# EAGLE design ledboard_smallcon_vert (EAGLE 6.4)
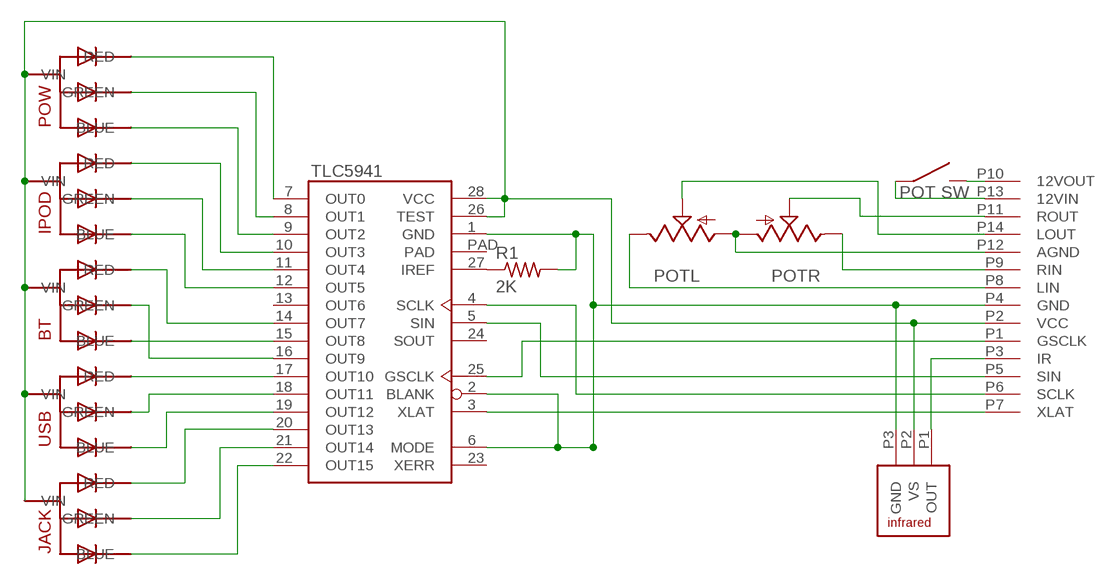
[diagram p0: schematic, sheet 1]

## Parts
BT  5MMRGBLEDBENT  [BENTLED]
IPOD  5MMRGBLEDBENT  [BENTLED]
IR  TSOP323  [TSOP323]
JACK  5MMRGBLEDBENT  [BENTLED]
POT  ALPS_RK0971221Z0N  [ALPS_RK0971221Z0X]
POW  5MMRGBLEDBENT  [BENTLED]
R1  2K  R-US_0207/7  [0207/7]
U$1  TLC5941  [HTSSOP28_POWERPAD]
U$3  CONNECTORSMALL2  [SMALL2]
USB  5MMRGBLEDBENT  [BENTLED]

## Nets
GND: IR.P3(GND) R1.2 U$1.1(GND) U$1.2(BLANK) U$1.6(MODE) U$3.P4(GND)
N$2: POW.P$4(RED) U$1.7(OUT0)
N$3: POW.P$2(GREEN) U$1.8(OUT1)
N$4: POW.P$1(BLUE) U$1.9(OUT2)
N$5: IPOD.P$4(RED) U$1.10(OUT3)
N$6: IPOD.P$2(GREEN) U$1.11(OUT4)
N$7: IPOD.P$1(BLUE) U$1.12(OUT5)
N$8: BT.P$4(RED) U$1.14(OUT7)
N$9: BT.P$1(BLUE) U$1.15(OUT8)
N$10: U$1.19(OUT12) USB.P$1(BLUE)
N$11: JACK.P$1(BLUE) U$1.22(OUT15)
N$12: BT.P$2(GREEN) U$1.16(OUT9)
N$13: U$1.17(OUT10) USB.P$4(RED)
N$14: U$1.4(SCLK) U$3.P6(SCLK)
N$15: JACK.P$4(RED) U$1.20(OUT13)
N$16: POT.G1 POT.G2 U$3.P12(AGND)
N$17: U$1.18(OUT11) USB.P$2(GREEN)
N$18: JACK.P$2(GREEN) U$1.21(OUT14)
N$19: R1.1 U$1.27(IREF)
N$21: U$1.5(SIN) U$3.P5(SIN)
N$22: IR.P1(OUT) U$3.P3(IR)
N$23: POT.I1 U$3.P8(LIN)
N$24: U$1.25(GSCLK) U$3.P1(GSCLK)
N$25: U$1.3(XLAT) U$3.P7(XLAT)
N$26: POT.I2 U$3.P9(RIN)
N$27: POT.O1 U$3.P14(LOUT)
N$28: POT.O2 U$3.P11(ROUT)
N$29: POT.S1 U$3.P13(12VIN)
N$30: POT.S2 U$3.P10(12VOUT)
VCC: BT.P$3(VIN) IPOD.P$3(VIN) IR.P2(VS) JACK.P$3(VIN) POW.P$3(VIN) U$1.26(TEST) U$1.28(VCC) U$3.P2(VCC) USB.P$3(VIN)
Unconnected: U$1.13(OUT6) U$1.23(XERR) U$1.24(SOUT) U$1.PAD

## Library data of the parts
BT IPOD JACK POW USB = led_rgb:5MMRGBLED
IR = tsop321:TSOP323
POT = audio-pots:ALPS_RK0971221Z0*: ALPS RK0971221Z Dual-gang 9mm potentiometer for volume control, with SPST switch -05 model: 10K with "volume" taper -0N model: 50K with traditional audio taper
R1 = resistor:R-US_: RESISTOR, American symbol
U$1 = tlc594X:TLC5941
U$3 = connector:CONNECTOR

## Board
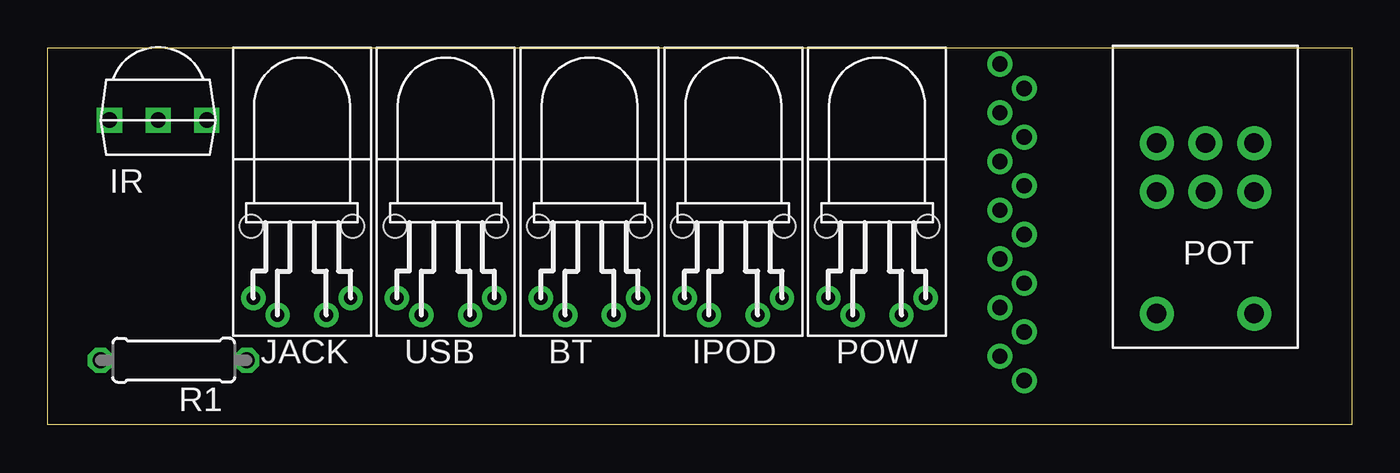
[diagram p1: board, top side]
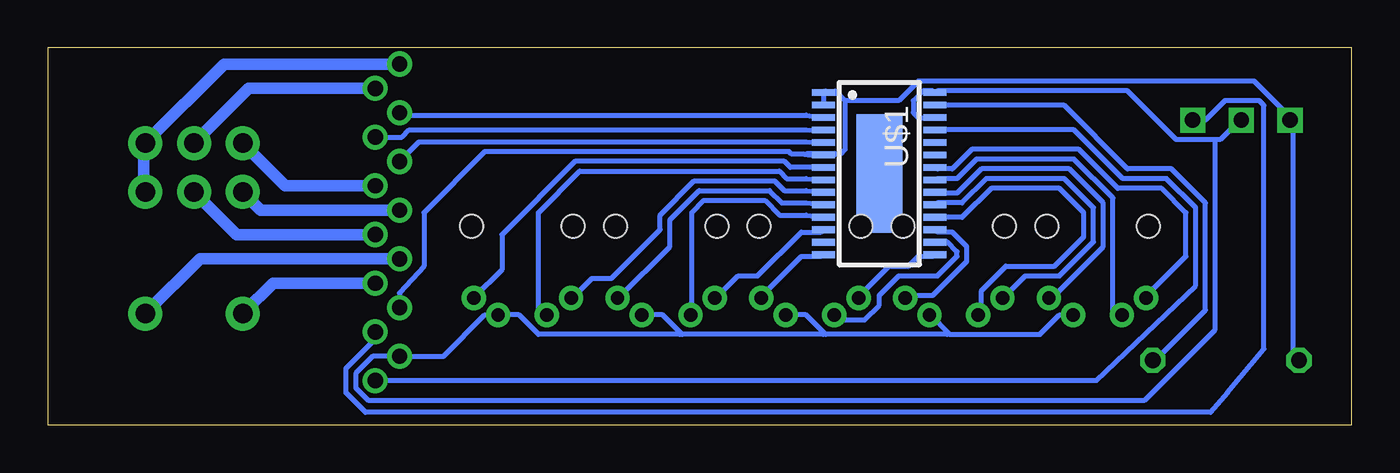
[diagram p2: board, bottom side, seen from below]

Size 68 x 19.65 mm. Coordinates in mm from the lower left corner, seen from the top.
Outline: 0,0 0,19.65 68,19.65 68,0 0,0
Copper layers (1*16): Top 0.035mm / dielectric 1.5mm / Bottom 0.035mm
Design rules "default *": minimum track width 10mil, minimum drill 24mil, track to track 8mil, track to pad 8mil, pad to pad 8mil, via to via 8mil, smd to smd 8mil, copper to edge 10mil, drill to drill 8mil, minimum pad ring 10mil, minimum via ring 8mil, stop-mask expansion 4mil, vias tented up to drill 0mil, thermal gap 10mil

### Footprints (pad centres in the part's own frame; a part is rotated, then mirrored left to right if it is on the bottom)
BENTLED = drill 0.7 pad 1.27: P$1 -2.54,-0.381; P$2 -1.27,-1.27; P$3 1.27,-1.27; P$4 2.54,-0.381 | hole 1.2: -2.65,3.35; 2.65,3.35
TSOP323 = drill 0.8 square: P1 2.54,0; P2 0,0; P3 -2.54,0
ALPS_RK0971221Z0X = drill 1.016 pad 1.778: G1 2.54,-2.54; G2 0,-2.54; I1 2.54,2.54; I2 0,2.54; O1 2.54,0; O2 0,0; S1 -6.35,-2.54; S2 -6.35,2.54
0207/7 = drill 0.813 octagon: 1 -3.81,0; 2 3.81,0
HTSSOP28_POWERPAD = smd 0.35 x 1.2: 1 -4.225,-2.9; 2 -3.575,-2.9; 3 -2.925,-2.9; 4 -2.275,-2.9; 5 -1.625,-2.9; 6 -0.975,-2.9; 7 -0.325,-2.9; 8 0.325,-2.9; 9 0.975,-2.9; 10 1.625,-2.9; 11 2.275,-2.9; 12 2.925,-2.9; 13 3.575,-2.9; 14 4.225,-2.9; 15 4.225,2.9; 16 3.575,2.9; 17 2.925,2.9; 18 2.275,2.9; 19 1.625,2.9; 20 0.975,2.9; 21 0.325,2.9; 22 -0.325,2.9; 23 -0.975,2.9; 24 -1.625,2.9; 25 -2.275,2.9; 26 -2.925,2.9; 27 -3.575,2.9; 28 -4.225,2.9 | smd 6.17 x 2.4: PAD 0,0
SMALL2 = drill 0.8: P1 -13.97,0; P2 -12.7,1.27; P3 -11.43,0; P4 -10.16,1.27; P5 -2.54,1.27; P6 -1.27,0; P7 0,1.27; P8 -3.81,0; P9 -5.08,1.27; P10 -8.89,0; P11 -6.35,0; P12 2.54,1.27; P13 -7.62,1.27; P14 1.27,0

### Placement (x,y rotation side)
BT  28.25,7 0 top
IPOD  35.75,7 0 top
IR  5.75,15.89 0 top
JACK  13.25,7 0 top
POT  60.38,12.15 90 top
POW  43.25,7 0 top
R1  6.56,3.36 180 top
U$1  24.64,13.1 270 bottom
U$3  50.93,16.27 90 top
USB  20.75,7 0 top

### Tracks (layer width: path | path; a pad name or v marks a point on that pad's centre or on a via)
GND
  Bottom 0.254: 3.05,15.89 5.08,17.92 22.61,17.92 23.62,16.91 26.42,16.91 | 27.43,17.41 U$1.1 27.56,17.29 27.56,16.78 U$1.2 | 3.05,2.94 2.79,3.19 R1.2 3.05,2.94 | 3.05,2.94 3.05,15.89 | 3.05,15.89 IR.P3 | 26.92,14.11 26.67,14.11 26.42,14.37 26.42,16.91 | 26.42,16.91 26.92,17.41 26.92,17.32 | U$3.P4 49.66,6.87 48.39,8.27 48.39,11.06 45.21,14.24 29.34,14.24 29.21,14.11 28.57,14.11 U$1.6
  Bottom 0.305: U$1.1 26.92,17.32 26.83,17.32 | 26.92,14.11 28.39,14.11 U$1.6
N$2
  Bottom 0.254: U$1.7 29.28,13.42 29.59,13.73 40.51,13.73 44.32,9.92 44.32,8.09 POW.P$4
N$3
  Bottom 0.254: U$1.8 28.45,12.84 29.46,12.84 29.84,13.22 40.26,13.22 42.42,11.06 42.42,6.11 42.04,5.73 POW.P$2
N$4
  Bottom 0.254: U$1.9 28.45,12.21 29.59,12.21 30.1,12.71 34.29,12.71 36.07,10.94 36.07,10.18 38.61,7.63 39.62,7.63 40.64,6.62 POW.P$1
N$5
  Bottom 0.254: U$1.10 28.45,11.57 29.72,11.57 30.35,12.21 34.04,12.21 35.56,10.68 35.56,9.29 38.23,6.62 IPOD.P$4
N$6
  Bottom 0.254: U$1.11 28.45,10.94 29.84,10.94 30.61,11.7 33.78,11.7 34.42,11.06 34.42,6.11 34.54,5.73 IPOD.P$2
N$7
  Bottom 0.254: U$1.12 27.69,10.05 28.7,10.05 30.99,7.76 32,7.76 33.02,6.75 IPOD.P$1
N$8
  Bottom 0.254: U$1.14 27.69,8.78 28.7,8.78 30.73,6.75 BT.P$4
N$9
  Bottom 0.254: U$1.15 21.84,8.78 22.61,8.78 23.11,8.27 24.13,8.27 25.65,6.75 BT.P$1
N$10
  Bottom 0.254: U$1.19 21.59,11.57 20.32,11.57 19.05,12.84 14.99,12.84 13.46,11.32 13.46,9.54 15.24,7.76 17.02,7.76 18.03,6.75 USB.P$1
N$11
  Bottom 0.254: U$1.22 21.59,13.35 20.83,13.35 19.81,14.37 14.22,14.37 12.19,12.33 9.91,12.33 8.64,11.06 8.64,8.78 10.67,6.75 JACK.P$1
N$12
  Bottom 0.254: U$1.16 21.59,9.54 21.08,9.54 20.57,9.03 20.57,8.78 21.59,7.76 23.62,7.76 24.64,6.75 24.64,6.24 25.4,5.48 26.67,5.48 26.92,5.73 BT.P$2
N$13
  Bottom 0.254: U$1.17 21.59,10.05 20.83,10.05 20.07,9.29 20.07,8.52 21.84,6.75 23.11,6.75 USB.P$4
N$14
  Bottom 0.254: U$3.P6 49.53,15 49.15,15.38 28.45,15.38 U$1.4
N$15
  Bottom 0.254: U$1.20 21.59,12.08 20.57,12.08 19.3,13.35 14.73,13.35 12.95,11.57 12.95,9.29 15.75,6.49 JACK.P$4
N$16
  Bottom 0.61: POT.G2 62.99,12.21 62.99,14.62 POT.G1 62.87,14.75 58.8,18.81 U$3.P12
N$17
  Bottom 0.254: U$1.18 21.59,10.81 20.32,10.81 18.8,12.33 15.24,12.33 13.97,11.06 13.97,9.79 15.49,8.27 18.03,8.27 19.3,7 19.3,5.73 USB.P$2
N$18
  Bottom 0.254: U$1.21 21.59,12.84 20.57,12.84 19.56,13.86 14.48,13.86 12.45,11.83 12.45,5.98 12.19,5.73 JACK.P$2
N$19
  Bottom 0.254: U$1.27 21.59,16.65 14.99,16.65 11.68,13.35 9.4,13.35 7.62,11.57 7.62,5.98 10.16,3.44 R1.1
N$21
  Bottom 0.254: U$3.P5 48.64,14.75 28.45,14.75 U$1.5
N$22
  Bottom 0.254: IR.P1 7.62,15.89 6.6,16.91 4.83,16.91 4.57,16.65 4.57,3.95 6.48,1.67 7.37,0.65 51.44,0.65 52.45,1.67 52.45,2.94 50.93,4.46 U$3.P3
N$23
  Bottom 0.61: U$3.P8 55.63,12.46 57.78,14.62 POT.I1
N$24
  Bottom 0.254: U$1.25 21.59,15.38 14.48,15.38 11.94,12.84 9.65,12.84 8.13,11.32 8.13,7.25 13.34,2.3 U$3.P1
N$25
  Bottom 0.254: U$3.P7 49.53,16.14 28.45,16.14 U$1.3
N$26
  Bottom 0.61: U$3.P9 56.9,11.19 57.78,12.08 POT.I2
N$27
  Bottom 0.61: U$3.P14 57.53,17.54 60.33,14.75 POT.O1
N$28
  Bottom 0.61: U$3.P11 58.17,9.92 60.33,12.08 POT.O2
N$29
  Bottom 0.61: U$3.P13 60.07,8.65 62.87,5.86 POT.S1
N$30
  Bottom 0.61: U$3.P10 56.26,7.38 57.78,5.86 POT.S2
VCC
  Bottom 0.254: U$1.26 21.84,16.02 22.61,16.02 22.86,16.27 22.86,16.91 22.35,17.41 21.84,17.41 U$1.28 21.59,17.41 11.68,17.41 9.14,14.87 7.11,14.87 | 7.11,14.87 6.86,14.87 5.84,15.89 IR.P2 | 7.11,14.87 7.11,4.97 10.79,1.29 51.31,1.29 51.94,1.92 51.94,2.68 51.05,3.57 U$3.P2 47.37,3.57 45.21,5.73 POW.P$3 43.43,5.73 42.42,4.71 35.05,4.71 34.99,4.78 | JACK.P$3 15.24,5.73 16.26,4.71 20.95,4.71 21.02,4.78 | 21.02,4.78 21.97,5.73 USB.P$3 | BT.P$3 28.45,5.73 27.5,4.78 | 27.5,4.78 27.43,4.71 21.08,4.71 21.02,4.78 | IPOD.P$3 35.94,5.73 34.99,4.78 | 34.99,4.78 34.92,4.71 27.56,4.71 27.5,4.78